# EAGLE schematic R211X (EAGLE 6.6.0)
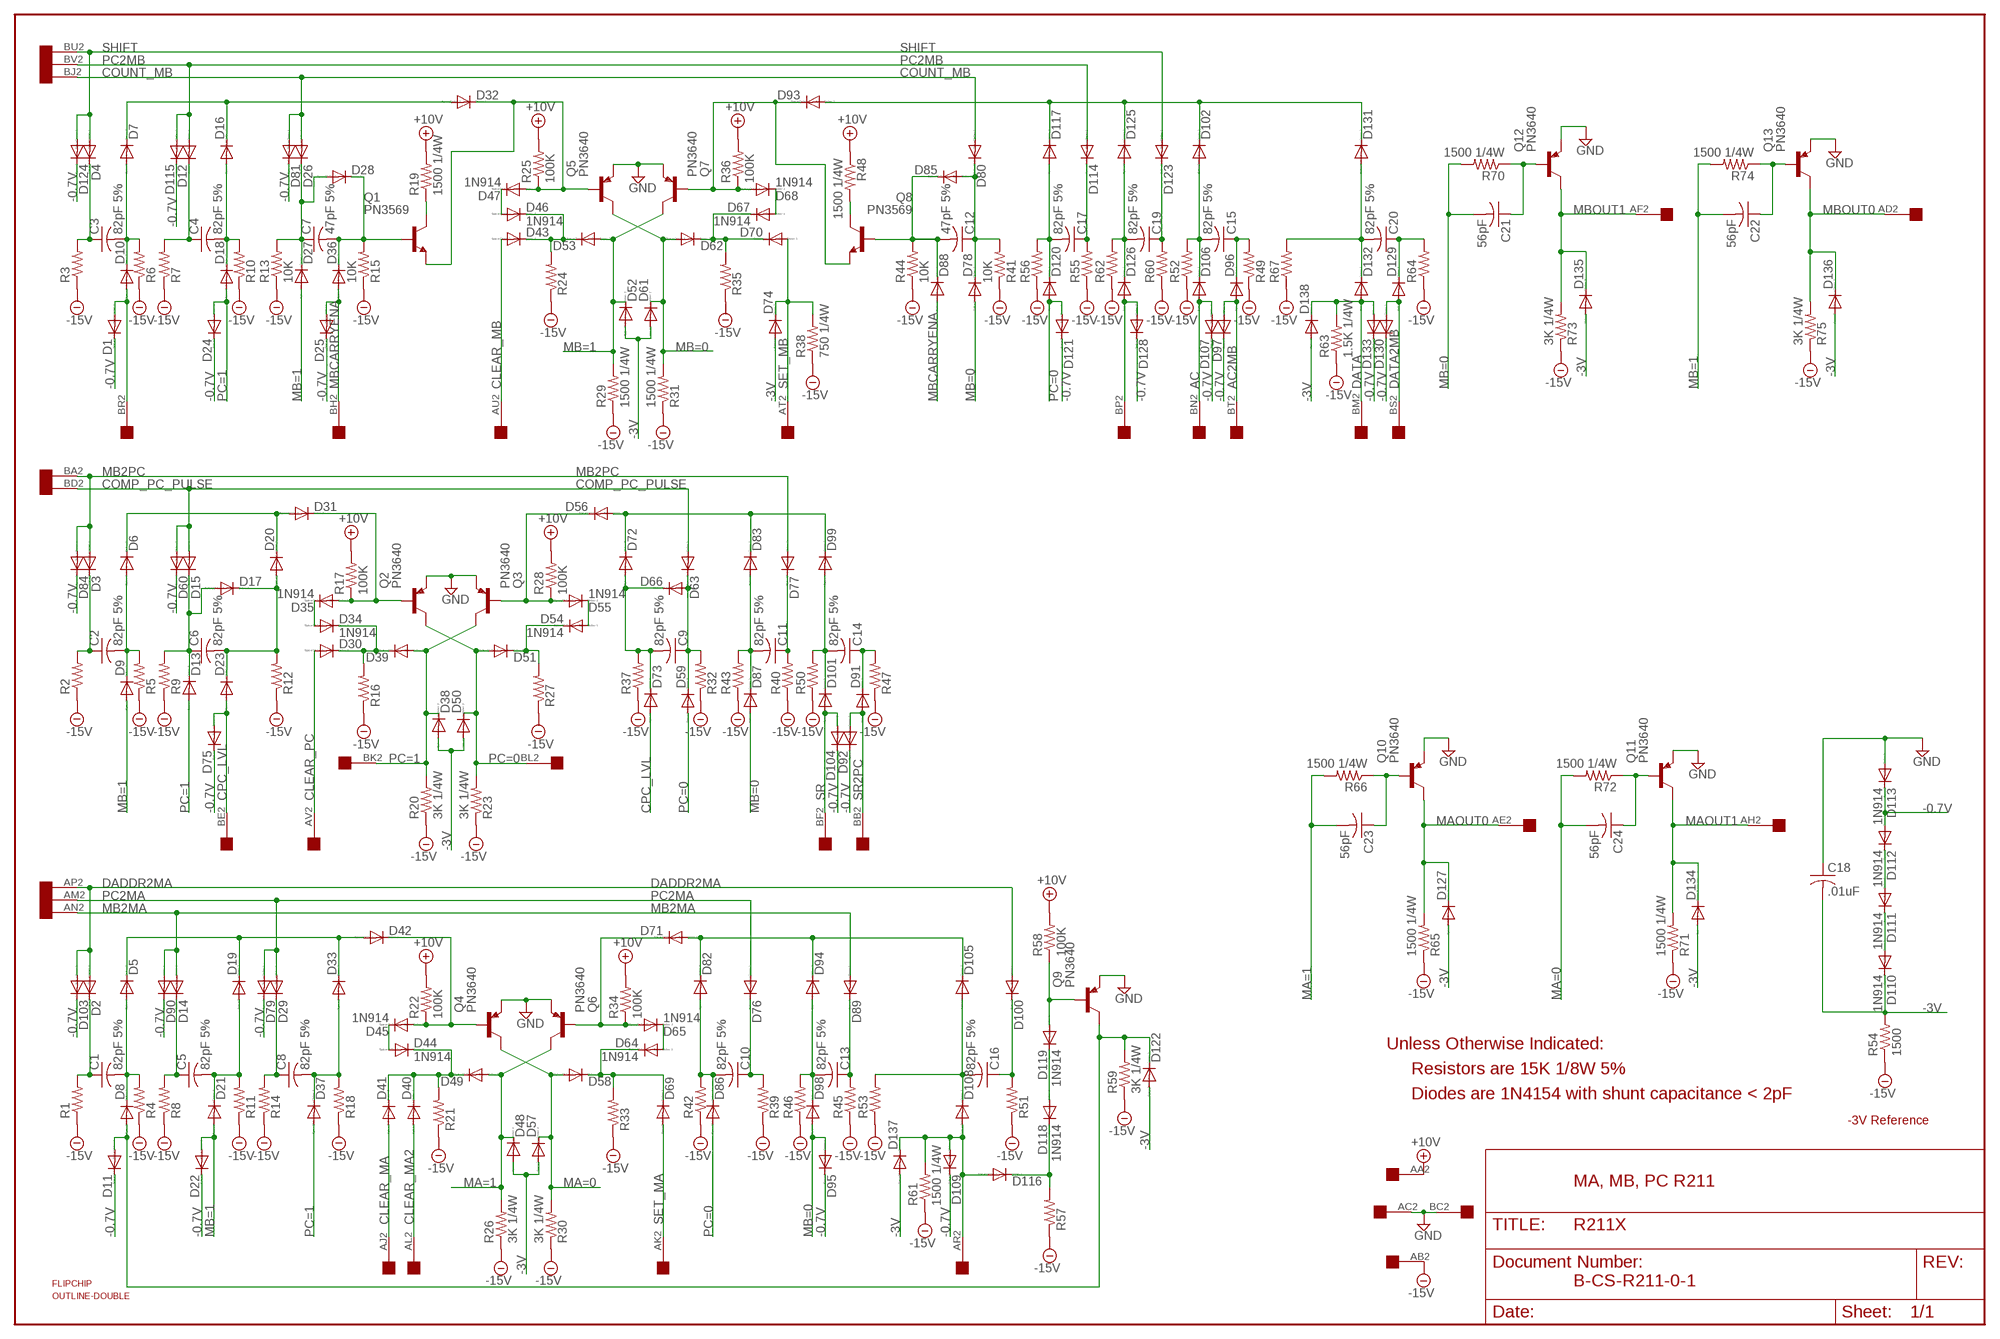
[diagram p0: schematic, sheet 1]

## Parts
C1  82pF 5%  C-US050-025X075  [C050-025X075]
C2  82pF 5%  C-US050-025X075  [C050-025X075]
C3  82pF 5%  C-US050-025X075  [C050-025X075]
C4  82pF 5%  C-US050-025X075  [C050-025X075]
C5  82pF 5%  C-US050-025X075  [C050-025X075]
C6  82pF 5%  C-US050-025X075  [C050-025X075]
C7  47pF 5%  C-US050-025X075  [C050-025X075]
C8  82pF 5%  C-US050-025X075  [C050-025X075]
C9  82pF 5%  C-US050-025X075  [C050-025X075]
C10  82pF 5%  C-US050-025X075  [C050-025X075]
C11  82pF 5%  C-US050-025X075  [C050-025X075]
C12  47pF 5%  C-US050-025X075  [C050-025X075]
C13  82pF 5%  C-US050-025X075  [C050-025X075]
C14  82pF 5%  C-US050-025X075  [C050-025X075]
C15  82pF 5%  C-US050-025X075  [C050-025X075]
C16  82pF 5%  C-US050-025X075  [C050-025X075]
C17  82pF 5%  C-US050-025X075  [C050-025X075]
C18  .01uF  C-US050-025X075  [C050-025X075]
C19  82pF 5%  C-US050-025X075  [C050-025X075]
C20  82pF 5%  C-US050-025X075  [C050-025X075]
C21  56pF  C-US050-025X075  [C050-025X075]
C22  56pF  C-US050-025X075  [C050-025X075]
C23  56pF  C-US050-025X075  [C050-025X075]
C24  56pF  C-US050-025X075  [C050-025X075]
D1  1N4148DO35-10  [DO35-10]
D2  1N4148DO35-10  [DO35-10]
D3  1N4148DO35-10  [DO35-10]
D4  1N4148DO35-10  [DO35-10]
D5  1N4148DO35-10  [DO35-10]
D6  1N4148DO35-10  [DO35-10]
D7  1N4148DO35-10  [DO35-10]
D8  1N4148DO35-10  [DO35-10]
D9  1N4148DO35-10  [DO35-10]
D10  1N4148DO35-10  [DO35-10]
D11  1N4148DO35-10  [DO35-10]
D12  1N4148DO35-10  [DO35-10]
D13  1N4148DO35-10  [DO35-10]
D14  1N4148DO35-10  [DO35-10]
D15  1N4148DO35-10  [DO35-10]
D16  1N4148DO35-10  [DO35-10]
D17  1N4148DO35-10  [DO35-10]
D18  1N4148DO35-10  [DO35-10]
D19  1N4148DO35-10  [DO35-10]
D20  1N4148DO35-10  [DO35-10]
D21  1N4148DO35-10  [DO35-10]
D22  1N4148DO35-10  [DO35-10]
D23  1N4148DO35-10  [DO35-10]
D24  1N4148DO35-10  [DO35-10]
D25  1N4148DO35-10  [DO35-10]
D26  1N4148DO35-10  [DO35-10]
D27  1N4148DO35-10  [DO35-10]
D28  1N4148DO35-10  [DO35-10]
D29  1N4148DO35-10  [DO35-10]
D30  1N4148DO35-10  [DO35-10]
D31  1N4148DO35-10  [DO35-10]
D32  1N4148DO35-10  [DO35-10]
D33  1N4148DO35-10  [DO35-10]
D34  1N914  1N4148DO35-10  [DO35-10]
D35  1N914  1N4148DO35-10  [DO35-10]
D36  1N4148DO35-10  [DO35-10]
D37  1N4148DO35-10  [DO35-10]
D38  1N4148DO35-10  [DO35-10]
D39  1N4148DO35-10  [DO35-10]
D40  1N4148DO35-10  [DO35-10]
D41  1N4148DO35-10  [DO35-10]
D42  1N4148DO35-10  [DO35-10]
D43  1N4148DO35-10  [DO35-10]
D44  1N914  1N4148DO35-10  [DO35-10]
D45  1N914  1N4148DO35-10  [DO35-10]
D46  1N914  1N4148DO35-10  [DO35-10]
D47  1N914  1N4148DO35-10  [DO35-10]
D48  1N4148DO35-10  [DO35-10]
D49  1N4148DO35-10  [DO35-10]
D50  1N4148DO35-10  [DO35-10]
D51  1N4148DO35-10  [DO35-10]
D52  1N4148DO35-10  [DO35-10]
D53  1N4148DO35-10  [DO35-10]
D54  1N914  1N4148DO35-10  [DO35-10]
D55  1N914  1N4148DO35-10  [DO35-10]
D56  1N4148DO35-10  [DO35-10]
D57  1N4148DO35-10  [DO35-10]
D58  1N4148DO35-10  [DO35-10]
D59  1N4148DO35-10  [DO35-10]
D60  1N4148DO35-10  [DO35-10]
D61  1N4148DO35-10  [DO35-10]
D62  1N4148DO35-10  [DO35-10]
D63  1N4148DO35-10  [DO35-10]
D64  1N914  1N4148DO35-10  [DO35-10]
D65  1N914  1N4148DO35-10  [DO35-10]
D66  1N4148DO35-10  [DO35-10]
D67  1N914  1N4148DO35-10  [DO35-10]
D68  1N914  1N4148DO35-10  [DO35-10]
D69  1N4148DO35-10  [DO35-10]
D70  1N4148DO35-10  [DO35-10]
D71  1N4148DO35-10  [DO35-10]
D72  1N4148DO35-10  [DO35-10]
D73  1N4148DO35-10  [DO35-10]
D74  1N4148DO35-10  [DO35-10]
D75  1N4148DO35-10  [DO35-10]
D76  1N4148DO35-10  [DO35-10]
D77  1N4148DO35-10  [DO35-10]
D78  1N4148DO35-10  [DO35-10]
D79  1N4148DO35-10  [DO35-10]
D80  1N4148DO35-10  [DO35-10]
D81  1N4148DO35-10  [DO35-10]
D82  1N4148DO35-10  [DO35-10]
D83  1N4148DO35-10  [DO35-10]
D84  1N4148DO35-10  [DO35-10]
D85  1N4148DO35-10  [DO35-10]
D86  1N4148DO35-10  [DO35-10]
D87  1N4148DO35-10  [DO35-10]
D88  1N4148DO35-10  [DO35-10]
D89  1N4148DO35-10  [DO35-10]
D90  1N4148DO35-10  [DO35-10]
D91  1N4148DO35-10  [DO35-10]
D92  1N4148DO35-10  [DO35-10]
D93  1N4148DO35-10  [DO35-10]
D94  1N4148DO35-10  [DO35-10]
D95  1N4148DO35-10  [DO35-10]
D96  1N4148DO35-10  [DO35-10]
D97  1N4148DO35-10  [DO35-10]
D98  1N4148DO35-10  [DO35-10]
D99  1N4148DO35-10  [DO35-10]
D100  1N4148DO35-10  [DO35-10]
D101  1N4148DO35-10  [DO35-10]
D102  1N4148DO35-10  [DO35-10]
D103  1N4148DO35-10  [DO35-10]
D104  1N4148DO35-10  [DO35-10]
D105  1N4148DO35-10  [DO35-10]
D106  1N4148DO35-10  [DO35-10]
D107  1N4148DO35-10  [DO35-10]
D108  1N4148DO35-10  [DO35-10]
D109  1N4148DO35-10  [DO35-10]
D110  1N914  1N4148DO35-10  [DO35-10]
D111  1N914  1N4148DO35-10  [DO35-10]
D112  1N914  1N4148DO35-10  [DO35-10]
D113  1N914  1N4148DO35-10  [DO35-10]
D114  1N4148DO35-10  [DO35-10]
D115  1N4148DO35-10  [DO35-10]
D116  1N4148DO35-10  [DO35-10]
D117  1N4148DO35-10  [DO35-10]
D118  1N914  1N4148DO35-10  [DO35-10]
D119  1N914  1N4148DO35-10  [DO35-10]
D120  1N4148DO35-10  [DO35-10]
D121  1N4148DO35-10  [DO35-10]
D122  1N4148DO35-10  [DO35-10]
D123  1N4148DO35-10  [DO35-10]
D124  1N4148DO35-10  [DO35-10]
D125  1N4148DO35-10  [DO35-10]
D126  1N4148DO35-10  [DO35-10]
D127  1N4148DO35-10  [DO35-10]
D128  1N4148DO35-10  [DO35-10]
D129  1N4148DO35-10  [DO35-10]
D130  1N4148DO35-10  [DO35-10]
D131  1N4148DO35-10  [DO35-10]
D132  1N4148DO35-10  [DO35-10]
D133  1N4148DO35-10  [DO35-10]
D134  1N4148DO35-10  [DO35-10]
D135  1N4148DO35-10  [DO35-10]
D136  1N4148DO35-10  [DO35-10]
D137  1N4148DO35-10  [DO35-10]
D138  1N4148DO35-10  [DO35-10]
Q1  PN3569  2N2102  [TO5]
Q2  PN3640  2N3637  [TO39]
Q3  PN3640  2N3637  [TO39]
Q4  PN3640  2N3637  [TO39]
Q5  PN3640  2N3637  [TO39]
Q6  PN3640  2N3637  [TO39]
Q7  PN3640  2N3637  [TO39]
Q8  PN3569  2N2102  [TO5]
Q9  PN3640  2N3637  [TO39]
Q10  PN3640  2N3637  [TO39]
Q11  PN3640  2N3637  [TO39]
Q12  PN3640  2N3637  [TO39]
Q13  PN3640  2N3637  [TO39]
R1  R-US_0207/10  [0207/10]
R2  R-US_0207/10  [0207/10]
R3  R-US_0207/10  [0207/10]
R4  R-US_0207/10  [0207/10]
R5  R-US_0207/10  [0207/10]
R6  R-US_0207/10  [0207/10]
R7  R-US_0207/10  [0207/10]
R8  R-US_0207/10  [0207/10]
R9  R-US_0207/10  [0207/10]
R10  R-US_0207/10  [0207/10]
R11  R-US_0207/10  [0207/10]
R12  R-US_0207/10  [0207/10]
R13  10K  R-US_0207/10  [0207/10]
R14  R-US_0207/10  [0207/10]
R15  10K  R-US_0207/10  [0207/10]
R16  R-US_0207/10  [0207/10]
R17  100K  R-US_0207/10  [0207/10]
R18  R-US_0207/10  [0207/10]
R19  1500 1/4W  R-US_0207/10  [0207/10]
R20  3K 1/4W  R-US_0207/10  [0207/10]
R21  R-US_0207/10  [0207/10]
R22  100K  R-US_0207/10  [0207/10]
R23  3K 1/4W  R-US_0207/10  [0207/10]
R24  R-US_0207/10  [0207/10]
R25  100K  R-US_0207/10  [0207/10]
R26  3K 1/4W  R-US_0207/10  [0207/10]
R27  R-US_0207/10  [0207/10]
R28  100K  R-US_0207/10  [0207/10]
R29  1500 1/4W  R-US_0207/10  [0207/10]
R30  3K 1/4W  R-US_0207/10  [0207/10]
R31  1500 1/4W  R-US_0207/10  [0207/10]
R32  R-US_0207/10  [0207/10]
R33  R-US_0207/10  [0207/10]
R34  100K  R-US_0207/10  [0207/10]
R35  R-US_0207/10  [0207/10]
R36  100K  R-US_0207/10  [0207/10]
R37  R-US_0207/10  [0207/10]
R38  750 1/4W  R-US_0207/10  [0207/10]
R39  R-US_0207/10  [0207/10]
R40  R-US_0207/10  [0207/10]
R41  10K  R-US_0207/10  [0207/10]
R42  R-US_0207/10  [0207/10]
R43  R-US_0207/10  [0207/10]
R44  10K  R-US_0207/10  [0207/10]
R45  R-US_0207/10  [0207/10]
R46  R-US_0207/10  [0207/10]
R47  R-US_0207/10  [0207/10]
R48  1500 1/4W  R-US_0207/10  [0207/10]
R49  R-US_0207/10  [0207/10]
R50  R-US_0207/10  [0207/10]
R51  R-US_0207/10  [0207/10]
R52  R-US_0207/10  [0207/10]
R53  R-US_0207/10  [0207/10]
R54  1500  R-US_0207/10  [0207/10]
R55  R-US_0207/10  [0207/10]
R56  R-US_0207/10  [0207/10]
R57  R-US_0207/10  [0207/10]
R58  100K  R-US_0207/10  [0207/10]
R59  3K 1/4W  R-US_0207/10  [0207/10]
R60  R-US_0207/10  [0207/10]
R61  1500 1/4W  R-US_0207/10  [0207/10]
R62  R-US_0207/10  [0207/10]
R63  1.5K 1/4W  R-US_0207/10  [0207/10]
R64  R-US_0207/10  [0207/10]
R65  1500 1/4W  R-US_0207/10  [0207/10]
R66  1500 1/4W  R-US_0207/10  [0207/10]
R67  R-US_0207/10  [0207/10]
R70  1500 1/4W  R-US_0207/10  [0207/10]
R71  1500 1/4W  R-US_0207/10  [0207/10]
R72  1500 1/4W  R-US_0207/10  [0207/10]
R73  3K 1/4W  R-US_0207/10  [0207/10]
R74  1500 1/4W  R-US_0207/10  [0207/10]
R75  3K 1/4W  R-US_0207/10  [0207/10]
U$1  DOUBLE  [EDGE-CON4]
U$2  FLIPCHIP  [FLIPCHIP]
U$3  OUTLINE-DOUBLE  [DOUBLE]

## Nets
+10V [Power]: R17.2 R19.2 R22.2 R25.2 R28.2 R34.2 R36.2 R48.1 R58.2 U$1.AA2
-0.7V [Power]: D1.C D11.C D22.C D24.C D25.C D60.C D75.C D79.C D81.C D84.C D90.C D92.C D95.C D97.C D103.C D104.C D107.C D109.C D112.A D113.C D115.C D121.C D124.C D128.C D130.C D133.C
-3V [Power]: C18.2 D38.A D48.A D50.A D52.A D57.A D61.A D74.A D110.C D122.A D127.A D134.A D135.A D136.A D137.A D138.A R54.2
-15V [Power]: R1.1 R2.1 R3.1 R4.1 R5.1 R6.1 R7.1 R8.1 R9.1 R10.1 R11.1 R12.1 R13.1 R14.1 R15.1 R16.1 R18.1 R20.1 R21.1 R23.1 R24.1 R26.1 R27.1 R29.1 R30.1 R31.1 R32.1 R33.1 R35.1 R37.1 R38.1 R39.1 R40.1 R41.1 R42.1 R43.1 R44.1 R45.1 R46.1 R47.1 R49.1 R50.1 R51.1 R52.1 R53.1 R54.1 R55.1 R56.1 R57.1 R59.1 R60.1 R61.1 R62.1 R63.1 R64.1 R65.1 R67.1 R71.1 R73.1 R75.1 U$1.AB2
AC: D106.A D107.A U$1.BN2
AC2MB: D96.A D97.A U$1.BT2
CLEAR_MA: D41.A U$1.AJ2
CLEAR_MA2: D40.A U$1.AL2
CLEAR_MB: D43.A U$1.AU2
CLEAR_PC: D30.A U$1.AV2
COMP_PC_PULSE: D15.A D60.A D63.A U$1.BD2
COUNT_MB: D26.A D80.A D81.A U$1.BJ2
CPC_LVL: D23.A D73.A D75.A U$1.BE2
DADDR2MA: D2.A D100.A D103.A U$1.AP2
DATA: D132.A D133.A D138.C R63.2 U$1.BM2
DATA2MB: D129.A D130.A U$1.BS2
GND [Power]: C18.1 D113.A Q2.1(E) Q3.1(E) Q4.1(E) Q5.1(E) Q6.1(E) Q7.1(E) Q9.1(E) Q10.1(E) Q11.1(E) Q12.1(E) Q13.1(E) U$1.AC2 U$1.BC2
MA=0: C24.2 D57.C D58.A Q4.3(C) R30.2 R72.2
MA=1: C23.2 D48.C D49.A Q6.3(C) R26.2 R66.2
MAOUT0: D127.C Q10.3(C) R65.2 U$1.AE2
MAOUT1: D134.C Q11.3(C) R71.2 U$1.AH2
MB2MA: D14.A D89.A D90.A U$1.AN2
MB2PC: D3.A D77.A D84.A U$1.BA2
MB=0: C21.2 D61.C D62.A D78.A D87.A D95.A D98.A Q5.3(C) R31.2 R70.2
MB=1: C22.2 D9.A D21.A D22.A D27.A D52.C D53.A Q7.3(C) R29.2 R74.2
MBCARRYENA: D25.A D36.A D88.A U$1.BH2
MBOUT0: D136.C Q13.3(C) R75.2 U$1.AD2
MBOUT1: D135.C Q12.3(C) R73.2 U$1.AF2
N$1: D7.C D16.C D32.A
N$2: C2.2 D6.A D9.C R5.2
N$3: C3.2 D7.A D10.C R6.2
N$4: C3.1 D4.C R3.2
N$5: C2.1 D3.C R2.2
N$6: C4.1 D12.C R7.2
N$7: C4.2 D16.A D18.C R10.2
N$8: Q1.3(C) R19.1
N$9: D46.A D47.C
N$10: D43.C D46.C D53.C R24.2
N$11: D32.C D47.A Q1.1(E) Q5.2(B) R25.1
N$12: C7.1 D26.C D27.C D28.A R13.2
N$13: D111.A D112.C
N$14: C7.2 D28.C D36.C Q1.2(B) R15.2
N$15: D93.A D102.C D117.C D125.C D131.C
N$16: D110.A D111.C
N$17: C1.2 D5.A D8.C R4.2
N$18: D67.A D68.C
N$19: D62.C D67.C D70.C R35.2
N$20: C12.2 D85.C D88.C Q8.2(B) R44.2
N$21: D68.A D93.C Q7.2(B) Q8.1(E) R36.1
N$22: C1.1 D2.C R1.2
N$23: D5.C D19.C D33.C D42.A
N$24: C13.2 D94.A D98.C R46.2
N$26: D126.A D128.A U$1.BP2
N$28: C5.1 D14.C R8.2
N$29: D6.C D20.C D31.A
N$30: C6.1 D13.C D15.C D17.A R9.2
N$31: C6.2 D17.C D20.A D23.C R12.2
N$32: D30.C D34.C D39.C R16.2
N$33: D54.A D55.C
N$34: C9.1 D59.C D63.C D66.A R32.2
N$35: C11.1 D77.C R40.2
N$36: C11.2 D83.A D87.C R43.2
N$37: C12.1 D78.C D80.C D85.A R41.2
N$38: C14.1 D91.C R47.2
N$39: C14.2 D99.A D101.C R50.2
N$40: C5.2 D19.A D21.C R11.2
N$41: C17.1 D114.C R55.2
N$42: C17.2 D117.A D120.C R56.2
N$43: D1.A D10.A U$1.BR2
N$44: D40.C D41.C D44.C D49.C R21.2
N$45: C15.1 D96.C R49.2
N$46: C15.2 D102.A D106.C R52.2
N$47: D64.A D65.C
N$48: C10.1 D76.C R39.2
N$49: C20.1 D129.C R64.2
N$50: C20.2 D131.A D132.C R67.2
N$51: C13.1 D89.C R45.2
N$53: C19.1 D123.C R60.2
N$54: C19.2 D125.A D126.C R62.2
N$55: C16.1 D100.C R51.2
N$56: C16.2 D105.A D108.C R53.2
N$57: C22.1 Q13.2(B) R74.1
N$58: D108.A D109.A D116.A D137.C R61.2 U$1.AR2
N$59: D44.A D45.C
N$60: C21.1 Q12.2(B) R70.1
N$61: D71.A D82.C D94.C D105.C
N$62: D58.C D64.C D69.C R33.2
N$63: D34.A D35.C
N$64: D56.A D72.C D83.C D99.C
N$65: D51.C D54.C R27.2
N$66: C10.2 D82.A D86.C R42.2
N$67: C9.2 D66.C D72.A D73.C R37.2
N$68: D42.C D45.A Q4.2(B) R22.1
N$69: D65.A D71.C Q6.2(B) R34.1
N$70: D31.C D35.A Q2.2(B) R17.1
N$71: D55.A D56.C Q3.2(B) R28.1
N$73: D8.A D11.A D122.C Q9.3(C) R59.2
N$74: Q8.3(C) R48.2
N$75: C24.1 Q11.2(B) R72.1
N$77: C23.1 Q10.2(B) R66.1
N$80: C8.1 D29.C R14.2
N$81: C8.2 D33.A D37.C R18.2
N$82: D116.C D118.C R57.2
N$83: D118.A D119.C
N$84: D119.A Q9.2(B) R58.1
PC2MA: D29.A D76.A D79.A U$1.AM2
PC2MB: D12.A D114.A D115.A U$1.BV2
PC=0: D50.C D51.A D59.A D86.A D120.A D121.A Q2.3(C) R23.2 U$1.BL2
PC=1: D13.A D18.A D24.A D37.A D38.C D39.A Q3.3(C) R20.2 U$1.BK2
SET_MA: D69.A U$1.AK2
SET_MB: D70.A D74.C R38.2 U$1.AT2
SHIFT: D4.A D123.A D124.A U$1.BU2
SR: D101.A D104.A U$1.BF2
SR2PC: D91.A D92.A U$1.BB2
Unconnected: U$1.AA1 U$1.AB1 U$1.AC1 U$1.AD1 U$1.AE1 U$1.AF1 U$1.AH1 U$1.AJ1 U$1.AK1 U$1.AL1 U$1.AM1 U$1.AN1 U$1.AP1 U$1.AR1 U$1.AS1 U$1.AS2 U$1.AT1 U$1.AU1 U$1.AV1 U$1.BA1 U$1.BB1 U$1.BC1 U$1.BD1 U$1.BE1 U$1.BF1 U$1.BH1 U$1.BJ1 U$1.BK1 U$1.BL1 U$1.BM1 U$1.BN1 U$1.BP1 U$1.BR1 U$1.BS1 U$1.BT1 U$1.BU1 U$1.BV1

## Notes on the sheet
- Unless Otherwise Indicated:
- Resistors are 15K 1/8W 5%
- Diodes are 1N4154 with shunt capacitance < 2pF
- -3V Reference
- MA, MB, PC R211
- B-CS-R211-0-1

## Library data of the parts
C1-C24 = rcl:C-US: CAPACITOR, American symbol
D1-D138 = diode:1N4148: DIODE high speed (Philips)
Q1 Q8 = transistor-npn:2N2102: NPN Transistor
Q2-Q7 Q9-Q13 = transistor-pnp:2N3637*: PNP Transistror
R1-R67 R70-R75 = rcl:R-US_: RESISTOR, American symbol
U$1 = dec-con:DOUBLE: Double-Height DEC board
U$2 = dec-con:FLIPCHIP: FLIP CHIP Logo, component side
U$3 = dec-con:OUTLINE-*: Board outlines for DEC boards.

## Net classes
1 Power: width 0.813 mm